# Altium project UCD3138.PrjPcb
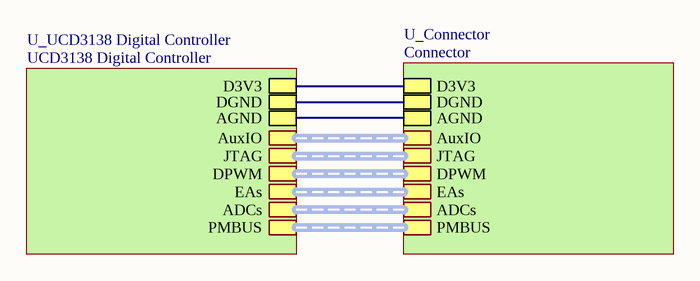
[diagram p0: UCD3138 Demo Board.SchDoc]
3 sheets, 77 parts. Net scope: hierarchical (ports join the sheet entries above them; power ports are global).
Board file: PCB1.PcbDoc
Sheets:
  UCD3138 Demo Board.SchDoc
    U_UCD3138 Digital Controller = UCD3138 Digital Controller.SchDoc
    U_Connector = Connector.SchDoc

## Sheet UCD3138 Demo Board.SchDoc: 模板
size A4; Author: Sunduoze; CompanyName: https://sunze.xyz/; Organization: Enze Co.; Revision: V1.0

### Sub-sheets
U_Connector = Connector: DGND, AGND, D3V3, ADCs (harness ADCx14), DPWM (harness DPWM), EAs (harness EA), AuxIO (harness AuxIO), JTAG (harness Debug), PMBUS (harness JTAG)
U_UCD3138 Digital Controller = UCD3138 Digital Controller: JTAG (harness Debug), DGND, ADCs (harness ADCx14), DPWM (harness DPWM), PMBUS (harness JTAG), EAs (harness EA), AGND, AuxIO (harness AuxIO), D3V3

### Nets
AGND: sheet U_UCD3138 Digital Controller/AGND, sheet U_Connector/AGND
D3V3: sheet U_UCD3138 Digital Controller/D3V3, sheet U_Connector/D3V3
DGND: sheet U_UCD3138 Digital Controller/DGND, sheet U_Connector/DGND

### Buses and harness runs
harness sheet U_Connector/ADCs = sheet U_UCD3138 Digital Controller/ADCs
harness sheet U_Connector/AuxIO = sheet U_UCD3138 Digital Controller/AuxIO
harness sheet U_Connector/DPWM = sheet U_UCD3138 Digital Controller/DPWM
harness sheet U_Connector/EAs = sheet U_UCD3138 Digital Controller/EAs
harness sheet U_Connector/JTAG = sheet U_UCD3138 Digital Controller/JTAG
harness sheet U_Connector/PMBUS = sheet U_UCD3138 Digital Controller/PMBUS

### Notes on the sheet
- 标题:
- 图纸:
- A4
- 作者:
- 日期:
- 版本:
- 主页:
- Enze

## Sheet UCD3138 Digital Controller.SchDoc: UCD3138
size A4; Author: Enzo.sun; CompanyName: https://sunze.xyz/; Organization: Enze Co.; Revision: V1.0
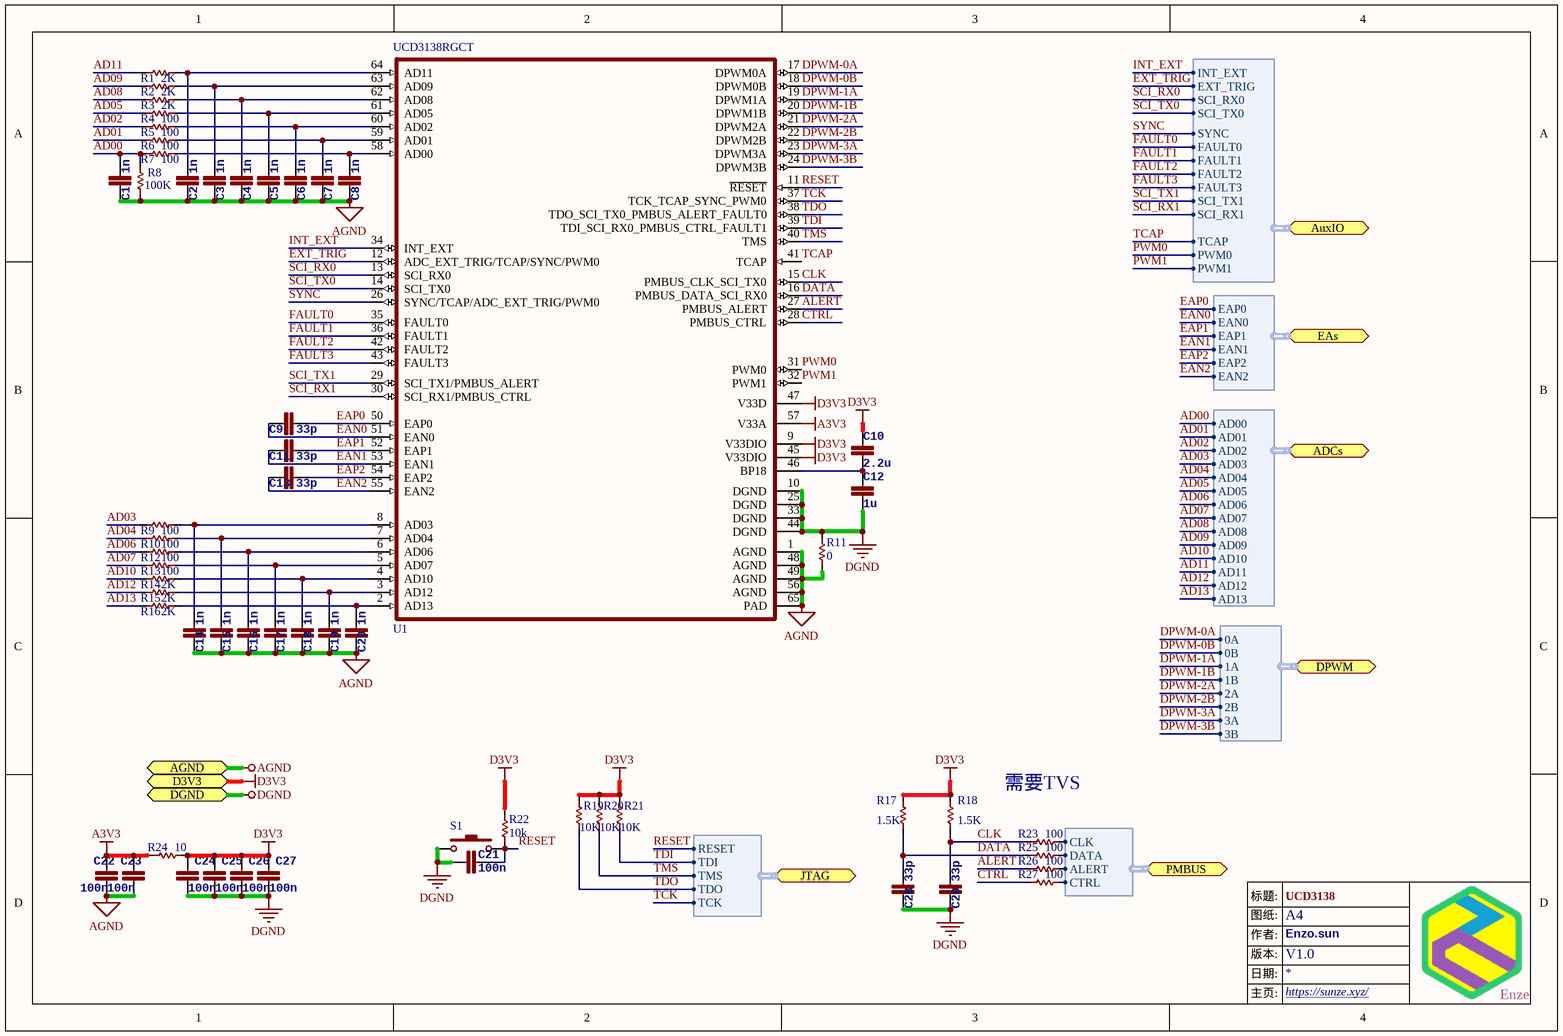
[diagram p1: UCD3138 Digital Controller.SchDoc]

### Parts
C1  1n  [0603-R/C-YG]
C2  1n  [0603-R/C-YG]
C3  1n  [0603-R/C-YG]
C4  1n  [0603-R/C-YG]
C5  1n  [0603-R/C-YG]
C6  1n  [0603-R/C-YG]
C7  1n  [0603-R/C-YG]
C8  1n  [0603-R/C-YG]
C9  33p  [0603-R/C-YG]
C10  2.2u  [0603-R/C-YG]
C11  33p  [0603-R/C-YG]
C12  1u  [0603-R/C-YG]
C13  33p  [0603-R/C-YG]
C14  1n  [0603-R/C-YG]
C15  1n  [0603-R/C-YG]
C16  1n  [0603-R/C-YG]
C17  1n  [0603-R/C-YG]
C18  1n  [0603-R/C-YG]
C19  1n  [0603-R/C-YG]
C20  1n  [0603-R/C-YG]
C21  100n  [0603-R/C-YG]
C22  100n  [0603-R/C-YG]
C23  100n  [0603-R/C-YG]
C24  100n  [0603-R/C-YG]
C25  100n  [0603-R/C-YG]
C26  100n  [0603-R/C-YG]
C27  100n  [0603-R/C-YG]
C28  33p  [0603-R/C-YG]
C29  33p  [0603-R/C-YG]
R1  2K  [0603-R-B]
R2  2K  [0603-R-B]
R3  2K  [0603-R-B]
R4  100  [0603-R-B]
R5  100  [0603-R-B]
R6  100  [0603-R-B]
R7  100  [0603-R-B]
R8  100K  [0603-R-B]
R9  100  [0603-R-B]
R10  100  [0603-R-B]
R11  0  [0805R]
R12  100  [0603-R-B]
R13  100  [0603-R-B]
R14  2K  [0603-R-B]
R15  2K  [0603-R-B]
R16  2K  [0603-R-B]
R17  1.5K  [0603-R-B]
R18  1.5K  [0603-R-B]
R19  10K  [0603-R-B]
R20  10K  [0603-R-B]
R21  10K  [0603-R-B]
R22  10k  [0603-R-B]
R23  100  [0603-R-B]
R24  10  [0805R]
R25  100  [0603-R-B]
R26  100  [0603-R-B]
R27  100  [0603-R-B]
S1  SW-PB  [SW-SMD1]  (value not drawn)
UCD3138RGCT  U1  [VQFN-64]

### Ports
ADCs (harness ADCx14), AGND, AuxIO (harness AuxIO), D3V3, DGND, DPWM (harness DPWM), EAs (harness EA), JTAG (harness Debug), PMBUS (harness JTAG)

### Harnesses
Debug: TMS, TCK, TDI, TDO, RESET
DPWM: 0A, 0B, 1B, 1A, 2B, 2A, 3B, 3A
ADCx14: AD00, AD01, AD02, AD03, AD04, AD05, AD06, AD07, AD08, AD09, AD10, AD11, AD12, AD13
JTAG: ALERT, DATA, CTRL, CLK
EA: EAP0, EAP1, EAP2, EAN0, EAN1, EAN2
AuxIO: INT_EXT, SCI_RX1, TCAP, SCI_TX1, EXT_TRIG, SCI_RX0, SCI_TX0, SYNC, FAULT0, FAULT1, FAULT2, FAULT3, PWM0, PWM1

### Nets
A3V3: C22.2 C23.2 R24.2 UCD3138RGCT.57(V33A)
AGND: C1.1 C2.1 C3.1 C4.1 C5.1 C6.1 C7.1 C8.1 C14.1 C15.1 C16.1 C17.1 C18.1 C19.1 C20.1 C22.1 C23.1 R8.2 R11.2 UCD3138RGCT.1(AGND) UCD3138RGCT.48(AGND) UCD3138RGCT.49(AGND) UCD3138RGCT.56(AGND) UCD3138RGCT.65(PAD) ; port AGND
D3V3: C10.2 C24.2 C25.2 C26.2 C27.2 R17.2 R18.2 R19.2 R20.2 R21.2 R22.2 R24.1 UCD3138RGCT.9(V33DIO) UCD3138RGCT.45(V33DIO) UCD3138RGCT.47(V33D) ; port D3V3
DGND: C12.1 C21.1 C24.1 C25.1 C26.1 C27.1 C28.1 C29.1 R11.1 S1.1 UCD3138RGCT.10(DGND) UCD3138RGCT.25(DGND) UCD3138RGCT.33(DGND) UCD3138RGCT.44(DGND) ; port DGND
AD00: C1.2 R7.2 R8.1 ; port ADCs.AD00
AD01: R6.2 ; port ADCs.AD01
AD02: R5.2 ; port ADCs.AD02
AD03: R9.2 ; port ADCs.AD03
AD04: R10.2 ; port ADCs.AD04
AD05: R4.2 ; port ADCs.AD05
AD06: R12.2 ; port ADCs.AD06
AD07: R13.2 ; port ADCs.AD07
AD08: R3.2 ; port ADCs.AD08
AD09: R2.2 ; port ADCs.AD09
AD10: R14.2 ; port ADCs.AD10
AD11: R1.2 ; port ADCs.AD11
AD12: R15.2 ; port ADCs.AD12
AD13: R16.2 ; port ADCs.AD13
ALERT: R26.2 UCD3138RGCT.27(PMBUS_ALERT)
ALERT: R26.1 ; port PMBUS.ALERT  [a separate net that carries the same name]
CLK: C29.2 R18.1 R23.2 UCD3138RGCT.15(PMBUS_CLK_SCI_TX0)
CLK: R23.1 ; port PMBUS.CLK  [a separate net that carries the same name]
CTRL: R27.2 UCD3138RGCT.28(PMBUS_CTRL)
CTRL: R27.1 ; port PMBUS.CTRL  [a separate net that carries the same name]
DATA: C28.2 R17.1 R25.2 UCD3138RGCT.16(PMBUS_DATA_SCI_RX0)
DATA: R25.1 ; port PMBUS.DATA  [a separate net that carries the same name]
DPWM-0A: UCD3138RGCT.17(DPWM0A) ; port DPWM.0A
DPWM-0B: UCD3138RGCT.18(DPWM0B) ; port DPWM.0B
DPWM-1A: UCD3138RGCT.19(DPWM1A) ; port DPWM.1A
DPWM-1B: UCD3138RGCT.20(DPWM1B) ; port DPWM.1B
DPWM-2A: UCD3138RGCT.21(DPWM2A) ; port DPWM.2A
DPWM-2B: UCD3138RGCT.22(DPWM2B) ; port DPWM.2B
DPWM-3A: UCD3138RGCT.23(DPWM3A) ; port DPWM.3A
DPWM-3B: UCD3138RGCT.24(DPWM3B) ; port DPWM.3B
EAN0: C9.1 UCD3138RGCT.51(EAN0) ; port EAs.EAN0
EAN1: C11.1 UCD3138RGCT.53(EAN1) ; port EAs.EAN1
EAN2: C13.1 UCD3138RGCT.55(EAN2) ; port EAs.EAN2
EAP0: C9.2 UCD3138RGCT.50(EAP0) ; port EAs.EAP0
EAP1: C11.2 UCD3138RGCT.52(EAP1) ; port EAs.EAP1
EAP2: C13.2 UCD3138RGCT.54(EAP2) ; port EAs.EAP2
EXT_TRIG: UCD3138RGCT.12(ADC_EXT_TRIG/TCAP/SYNC/PWM0) ; port AuxIO.EXT_TRIG
FAULT0: UCD3138RGCT.35(FAULT0) ; port AuxIO.FAULT0
FAULT1: UCD3138RGCT.36(FAULT1) ; port AuxIO.FAULT1
FAULT2: UCD3138RGCT.42(FAULT2) ; port AuxIO.FAULT2
FAULT3: UCD3138RGCT.43(FAULT3) ; port AuxIO.FAULT3
INT_EXT: UCD3138RGCT.34(INT_EXT) ; port AuxIO.INT_EXT
PWM0: UCD3138RGCT.31(PWM0) ; port AuxIO.PWM0
PWM1: UCD3138RGCT.32(PWM1) ; port AuxIO.PWM1
RESET: C21.2 R22.1 S1.2 UCD3138RGCT.11(~{RESET}) ; port JTAG.RESET
SCI_RX0: UCD3138RGCT.13(SCI_RX0) ; port AuxIO.SCI_RX0
SCI_RX1: UCD3138RGCT.30(SCI_RX1/PMBUS_CTRL) ; port AuxIO.SCI_RX1
SCI_TX0: UCD3138RGCT.14(SCI_TX0) ; port AuxIO.SCI_TX0
SCI_TX1: UCD3138RGCT.29(SCI_TX1/PMBUS_ALERT) ; port AuxIO.SCI_TX1
SYNC: UCD3138RGCT.26(SYNC/TCAP/ADC_EXT_TRIG/PWM0) ; port AuxIO.SYNC
TCAP: UCD3138RGCT.41(TCAP) ; port AuxIO.TCAP
TCK: UCD3138RGCT.37(TCK_TCAP_SYNC_PWM0) ; port JTAG.TCK
TDI: R21.1 UCD3138RGCT.39(TDI_SCI_RX0_PMBUS_CTRL_FAULT1) ; port JTAG.TDI
TDO: R19.1 UCD3138RGCT.38(TDO_SCI_TX0_PMBUS_ALERT_FAULT0) ; port JTAG.TDO
TMS: R20.1 UCD3138RGCT.40(TMS) ; port JTAG.TMS
NetC2_2: C2.2 R1.1 UCD3138RGCT.64(AD11)
NetC3_2: C3.2 R2.1 UCD3138RGCT.63(AD09)
NetC4_2: C4.2 R3.1 UCD3138RGCT.62(AD08)
NetC5_2: C5.2 R4.1 UCD3138RGCT.61(AD05)
NetC6_2: C6.2 R5.1 UCD3138RGCT.60(AD02)
NetC7_2: C7.2 R6.1 UCD3138RGCT.59(AD01)
NetC8_2: C8.2 R7.1 UCD3138RGCT.58(AD00)
NetC10_1: C10.1 C12.2 UCD3138RGCT.46(BP18)
NetC14_2: C14.2 R9.1 UCD3138RGCT.8(AD03)
NetC15_2: C15.2 R10.1 UCD3138RGCT.7(AD04)
NetC16_2: C16.2 R12.1 UCD3138RGCT.6(AD06)
NetC17_2: C17.2 R13.1 UCD3138RGCT.5(AD07)
NetC18_2: C18.2 R14.1 UCD3138RGCT.4(AD10)
NetC19_2: C19.2 R15.1 UCD3138RGCT.3(AD12)
NetC20_2: C20.2 R16.1 UCD3138RGCT.2(AD13)

### Notes on the sheet
- 需要TVS
- 标题:
- 图纸:
- A4
- 作者:
- 日期:
- 版本:
- 主页:
- Enze

### Library data of the parts
C1-C29 = Capacitor-M: <B>CAPACITOR</B>, European symbol
R1-R27 = Resistor-E: 电阻; Sim Note: Enter the Resistance value and the set point into parameter fields.; Set Position: 0.5; Value: 1K; Published: 8-Jun-2000; LatestRevisionDate: 17-Jul-2002; LatestRevisionNote: Re-released for DXP Platform.; PackageReference: VR5; Publisher: Altium Limited
S1 = SW-PB: Switch; Published: 24-Mar-1999; LatestRevisionDate: 17-Jul-2002; LatestRevisionNote: Re-released for DXP Platform.; PackageReference: SPST-2; Publisher: Altium Limited; PackageDescription: Switch; 2 Leads
UCD3138RGCT = UCD3138RGCT: 64Pins

## Sheet Connector.SchDoc: 模板
size A4; Author: Sunduoze; CompanyName: https://sunze.xyz/; Organization: Enze Co.; Revision: V1.0
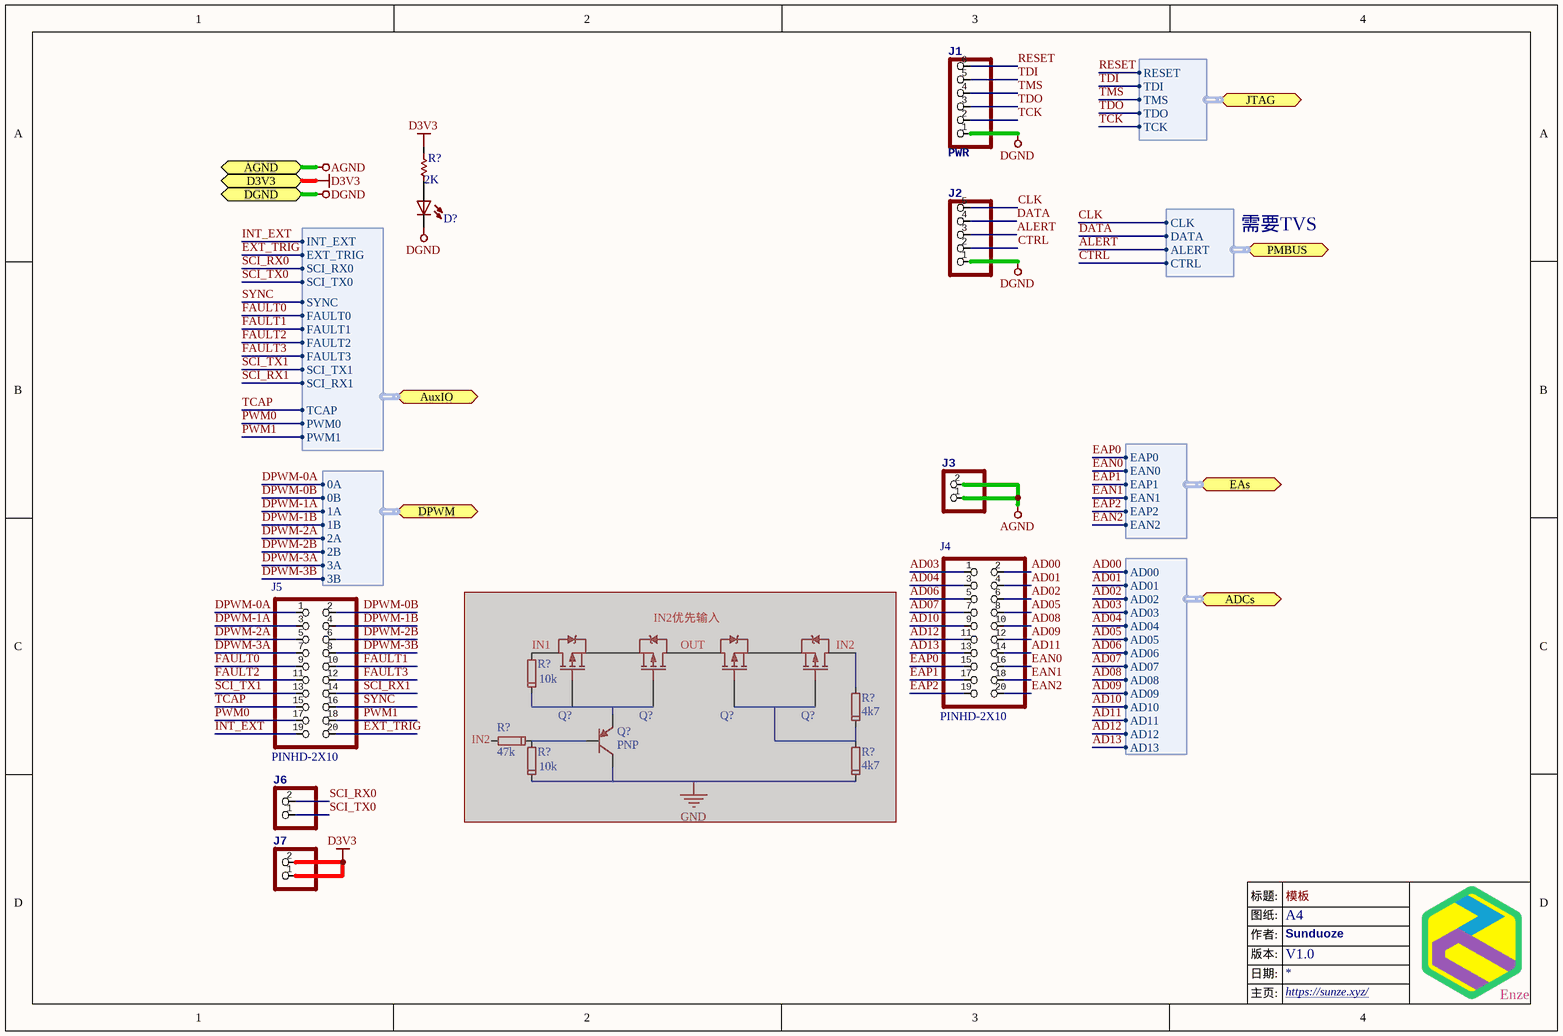
[diagram p2: Connector.SchDoc]

### Parts
(Parts that share a designator on the sheet are numbered #1, #2 ... from top to bottom, then left to right.)
D?  LED  [0603-LED-B]  (value not drawn)
J1  PWR  [1X06]
J2  PWR  [1X05]  (value not drawn)
J3  PWR  [1x02-LVPSFB]  (value not drawn)
J4  PINHD-2X10  [2X10]
J5  PINHD-2X10  [2X10]
J6  PWR  [1x02-LVPSFB]  (value not drawn)
J7  PWR  [1x02-LVPSFB]  (value not drawn)
Q?#1  Comment  (value not drawn)  (masked out: inside a compile mask, not in the netlist)
Q?#2  Comment  (value not drawn)  (masked out: inside a compile mask, not in the netlist)
Q?#3  Comment  (value not drawn)  (masked out: inside a compile mask, not in the netlist)
Q?#4  Comment  (value not drawn)  (masked out: inside a compile mask, not in the netlist)
Q?#5  PNP  [SOT-23-M-BJT]  (masked out: inside a compile mask, not in the netlist)
R?#1  2K  [0603-R-B]
R?#2  10k  [R0603]  (masked out: inside a compile mask, not in the netlist)
R?#3  4k7  [R0603]  (masked out: inside a compile mask, not in the netlist)
R?#4  47k  [R0603]  (masked out: inside a compile mask, not in the netlist)
R?#5  10k  [R0603]  (masked out: inside a compile mask, not in the netlist)
R?#6  4k7  [R0603]  (masked out: inside a compile mask, not in the netlist)

### Ports
ADCs (harness ADCx14), AGND, AuxIO (harness AuxIO), D3V3, DGND, DPWM (harness DPWM), EAs (harness EA), JTAG (harness Debug), PMBUS (harness JTAG)

### Harnesses
DPWM: 0A, 0B, 1B, 1A, 2B, 2A, 3B, 3A
ADCx14: AD00, AD01, AD02, AD03, AD04, AD05, AD06, AD07, AD08, AD09, AD10, AD11, AD12, AD13
EA: EAP0, EAP1, EAP2, EAN0, EAN1, EAN2
AuxIO: INT_EXT, SCI_RX1, TCAP, SCI_TX1, EXT_TRIG, SCI_RX0, SCI_TX0, SYNC, FAULT0, FAULT1, FAULT2, FAULT3, PWM0, PWM1
Debug: TMS, TCK, TDI, TDO, RESET
JTAG: ALERT, DATA, CTRL, CLK

### Nets
AGND: J3.1 J3.2 ; port AGND
D3V3: J7.1 J7.2 R?#1.2 ; port D3V3
DGND: D?.2(C) J1.1 J2.1 ; port DGND
AD00: J4.2 ; port ADCs.AD00
AD01: J4.4 ; port ADCs.AD01
AD02: J4.6 ; port ADCs.AD02
AD03: J4.1 ; port ADCs.AD03
AD04: J4.3 ; port ADCs.AD04
AD05: J4.8 ; port ADCs.AD05
AD06: J4.5 ; port ADCs.AD06
AD07: J4.7 ; port ADCs.AD07
AD08: J4.10 ; port ADCs.AD08
AD09: J4.12 ; port ADCs.AD09
AD10: J4.9 ; port ADCs.AD10
AD11: J4.14 ; port ADCs.AD11
AD12: J4.11 ; port ADCs.AD12
AD13: J4.13 ; port ADCs.AD13
ALERT: J2.3 ; port PMBUS.ALERT
CLK: J2.5 ; port PMBUS.CLK
CTRL: J2.2 ; port PMBUS.CTRL
DATA: J2.4 ; port PMBUS.DATA
DPWM-0A: J5.1 ; port DPWM.0A
DPWM-0B: J5.2 ; port DPWM.0B
DPWM-1A: J5.3 ; port DPWM.1A
DPWM-1B: J5.4 ; port DPWM.1B
DPWM-2A: J5.5 ; port DPWM.2A
DPWM-2B: J5.6 ; port DPWM.2B
DPWM-3A: J5.7 ; port DPWM.3A
DPWM-3B: J5.8 ; port DPWM.3B
EAN0: J4.16 ; port EAs.EAN0
EAN1: J4.18 ; port EAs.EAN1
EAN2: J4.20 ; port EAs.EAN2
EAP0: J4.15 ; port EAs.EAP0
EAP1: J4.17 ; port EAs.EAP1
EAP2: J4.19 ; port EAs.EAP2
EXT_TRIG: J5.20 ; port AuxIO.EXT_TRIG
FAULT0: J5.9 ; port AuxIO.FAULT0
FAULT1: J5.10 ; port AuxIO.FAULT1
FAULT2: J5.11 ; port AuxIO.FAULT2
FAULT3: J5.12 ; port AuxIO.FAULT3
INT_EXT: J5.19 ; port AuxIO.INT_EXT
PWM0: J5.17 ; port AuxIO.PWM0
PWM1: J5.18 ; port AuxIO.PWM1
RESET: J1.6 ; port JTAG.RESET
SCI_RX0: J6.2 ; port AuxIO.SCI_RX0
SCI_RX1: J5.14 ; port AuxIO.SCI_RX1
SCI_TX0: J6.1 ; port AuxIO.SCI_TX0
SCI_TX1: J5.13 ; port AuxIO.SCI_TX1
SYNC: J5.16 ; port AuxIO.SYNC
TCAP: J5.15 ; port AuxIO.TCAP
TCK: J1.2 ; port JTAG.TCK
TDI: J1.5 ; port JTAG.TDI
TDO: J1.3 ; port JTAG.TDO
TMS: J1.4 ; port JTAG.TMS
NetD?_1: D?.1(A) R?#1.1

### Notes on the sheet
- 需要TVS
- IN1
- (near Q?#2) IN2优先输入
- (near Q?#2) OUT
- (near Q?#4) IN2
- (near R?#4) IN2
- 标题:
- 图纸:
- A4
- 作者:
- 日期:
- 版本:
- 主页:
- Enze

### Library data of the parts
J1 = PINHD-1X6: 引脚头
J2 = PINHD-1X5: 引脚头
J3 J6 J7 = PINHD-1X2: 引脚头
J4 J5 = PINHD-2X10: 引脚头; >NAME: J1; >VALUE: PINHD-2X10
Q?#1-Q?#4 = PMOS: P-Channel MOSFET; Note: Pin 2 is electrically connected to pin 4.; Published: 8-Jun-2000; LatestRevisionDate: 17-Jul-2002; LatestRevisionNote: Re-released for DXP Platform.; DatasheetVersion: PD-9.814; PackageVersion: Feb-1997; PackageReference: TO-220AB; Publisher: Altium Limited; PackageDescription: TO, Thru-Hole, Vertical, Heatsink Mounted; 3 In-Line Leads; Pitch 2.54 mm; ComponentLink1Description: Manufacturer Link; ComponentLink1URL: http://www.irf.com/
Q?#5 = PNP: PNP  s8550-2ty(.5A) ss8550-y2(1.5A); Published: 8-Jun-2000; LatestRevisionDate: 15-Jan-2003; LatestRevisionNote: PCB Footprint 'BCY-W3/D4.7' replaced; DatasheetVersion: 1997; PackageVersion: Sep-1998; PackageReference: TO-92A; Publisher: Altium Limited; PackageDescription: TO, Flat Index; 3 In-Line, Axial Leads; Body Dia. 4.5mm; Leads 0.51 x 0.48 mm (max); ComponentLink1Description: Manufacturer Link; ComponentLink1URL: http://www.fairchildsemi.com/; ComponentLink2Description: Datasheet; ComponentLink2URL: http://www.fairchildsemi.com/ds/2N%2F2N3906.pdf
R?#1 = Resistor-E: as R1 on sheet UCD3138 Digital Controller; Published: 8-Jun-2000; LatestRevisionDate: 17-Jul-2002; LatestRevisionNote: Re-released for DXP Platform.; PackageReference: VR5; Publisher: Altium Limited
R?#2-R?#6 = Resistor
D? = LED: Published: 8-Jun-2000; LatestRevisionDate: 17-Dec-2003; LatestRevisionNote: PCB Footprint replaced.; DatasheetVersion: 16-Apr-2002; PackageVersion: 16-Apr-2002; PackageReference: 3.5X2.8X1.9; Publisher: Altium Limited; PackageDescription: SM LED; 2 C-Bend Leads; Body 3.5 x 2.8 x 1.9 mm, inc leads (LxWxH typ)

## Nets that join several sheets
AGND: UCD3138 Digital Controller (24 pins), Connector (J3.1 J3.2)
D3V3: UCD3138 Digital Controller (15 pins), Connector (J7.1 J7.2 R?#1.2)
DGND: UCD3138 Digital Controller (14 pins), Connector (D?.2 J1.1 J2.1)
AD00: UCD3138 Digital Controller (C1.2 R7.2 R8.1), Connector (J4.2)
AD01: UCD3138 Digital Controller (R6.2), Connector (J4.4)
AD02: UCD3138 Digital Controller (R5.2), Connector (J4.6)
AD03: UCD3138 Digital Controller (R9.2), Connector (J4.1)
AD04: UCD3138 Digital Controller (R10.2), Connector (J4.3)
AD05: UCD3138 Digital Controller (R4.2), Connector (J4.8)
AD06: UCD3138 Digital Controller (R12.2), Connector (J4.5)
AD07: UCD3138 Digital Controller (R13.2), Connector (J4.7)
AD08: UCD3138 Digital Controller (R3.2), Connector (J4.10)
AD09: UCD3138 Digital Controller (R2.2), Connector (J4.12)
AD10: UCD3138 Digital Controller (R14.2), Connector (J4.9)
AD11: UCD3138 Digital Controller (R1.2), Connector (J4.14)
AD12: UCD3138 Digital Controller (R15.2), Connector (J4.11)
AD13: UCD3138 Digital Controller (R16.2), Connector (J4.13)
ALERT: UCD3138 Digital Controller (R26.1), Connector (J2.3)
CLK: UCD3138 Digital Controller (R23.1), Connector (J2.5)
CTRL: UCD3138 Digital Controller (R27.1), Connector (J2.2)
DATA: UCD3138 Digital Controller (R25.1), Connector (J2.4)
DPWM-0A: UCD3138 Digital Controller (UCD3138RGCT.17), Connector (J5.1)
DPWM-0B: UCD3138 Digital Controller (UCD3138RGCT.18), Connector (J5.2)
DPWM-1A: UCD3138 Digital Controller (UCD3138RGCT.19), Connector (J5.3)
DPWM-1B: UCD3138 Digital Controller (UCD3138RGCT.20), Connector (J5.4)
DPWM-2A: UCD3138 Digital Controller (UCD3138RGCT.21), Connector (J5.5)
DPWM-2B: UCD3138 Digital Controller (UCD3138RGCT.22), Connector (J5.6)
DPWM-3A: UCD3138 Digital Controller (UCD3138RGCT.23), Connector (J5.7)
DPWM-3B: UCD3138 Digital Controller (UCD3138RGCT.24), Connector (J5.8)
EAN0: UCD3138 Digital Controller (C9.1 UCD3138RGCT.51), Connector (J4.16)
EAN1: UCD3138 Digital Controller (C11.1 UCD3138RGCT.53), Connector (J4.18)
EAN2: UCD3138 Digital Controller (C13.1 UCD3138RGCT.55), Connector (J4.20)
EAP0: UCD3138 Digital Controller (C9.2 UCD3138RGCT.50), Connector (J4.15)
EAP1: UCD3138 Digital Controller (C11.2 UCD3138RGCT.52), Connector (J4.17)
EAP2: UCD3138 Digital Controller (C13.2 UCD3138RGCT.54), Connector (J4.19)
EXT_TRIG: UCD3138 Digital Controller (UCD3138RGCT.12), Connector (J5.20)
FAULT0: UCD3138 Digital Controller (UCD3138RGCT.35), Connector (J5.9)
FAULT1: UCD3138 Digital Controller (UCD3138RGCT.36), Connector (J5.10)
FAULT2: UCD3138 Digital Controller (UCD3138RGCT.42), Connector (J5.11)
FAULT3: UCD3138 Digital Controller (UCD3138RGCT.43), Connector (J5.12)
INT_EXT: UCD3138 Digital Controller (UCD3138RGCT.34), Connector (J5.19)
PWM0: UCD3138 Digital Controller (UCD3138RGCT.31), Connector (J5.17)
PWM1: UCD3138 Digital Controller (UCD3138RGCT.32), Connector (J5.18)
RESET: UCD3138 Digital Controller (C21.2 R22.1 S1.2 UCD3138RGCT.11), Connector (J1.6)
SCI_RX0: UCD3138 Digital Controller (UCD3138RGCT.13), Connector (J6.2)
SCI_RX1: UCD3138 Digital Controller (UCD3138RGCT.30), Connector (J5.14)
SCI_TX0: UCD3138 Digital Controller (UCD3138RGCT.14), Connector (J6.1)
SCI_TX1: UCD3138 Digital Controller (UCD3138RGCT.29), Connector (J5.13)
SYNC: UCD3138 Digital Controller (UCD3138RGCT.26), Connector (J5.16)
TCAP: UCD3138 Digital Controller (UCD3138RGCT.41), Connector (J5.15)
TCK: UCD3138 Digital Controller (UCD3138RGCT.37), Connector (J1.2)
TDI: UCD3138 Digital Controller (R21.1 UCD3138RGCT.39), Connector (J1.5)
TDO: UCD3138 Digital Controller (R19.1 UCD3138RGCT.38), Connector (J1.3)
TMS: UCD3138 Digital Controller (R20.1 UCD3138RGCT.40), Connector (J1.4)